# EAGLE design lsmod (EAGLE 7.6.0)
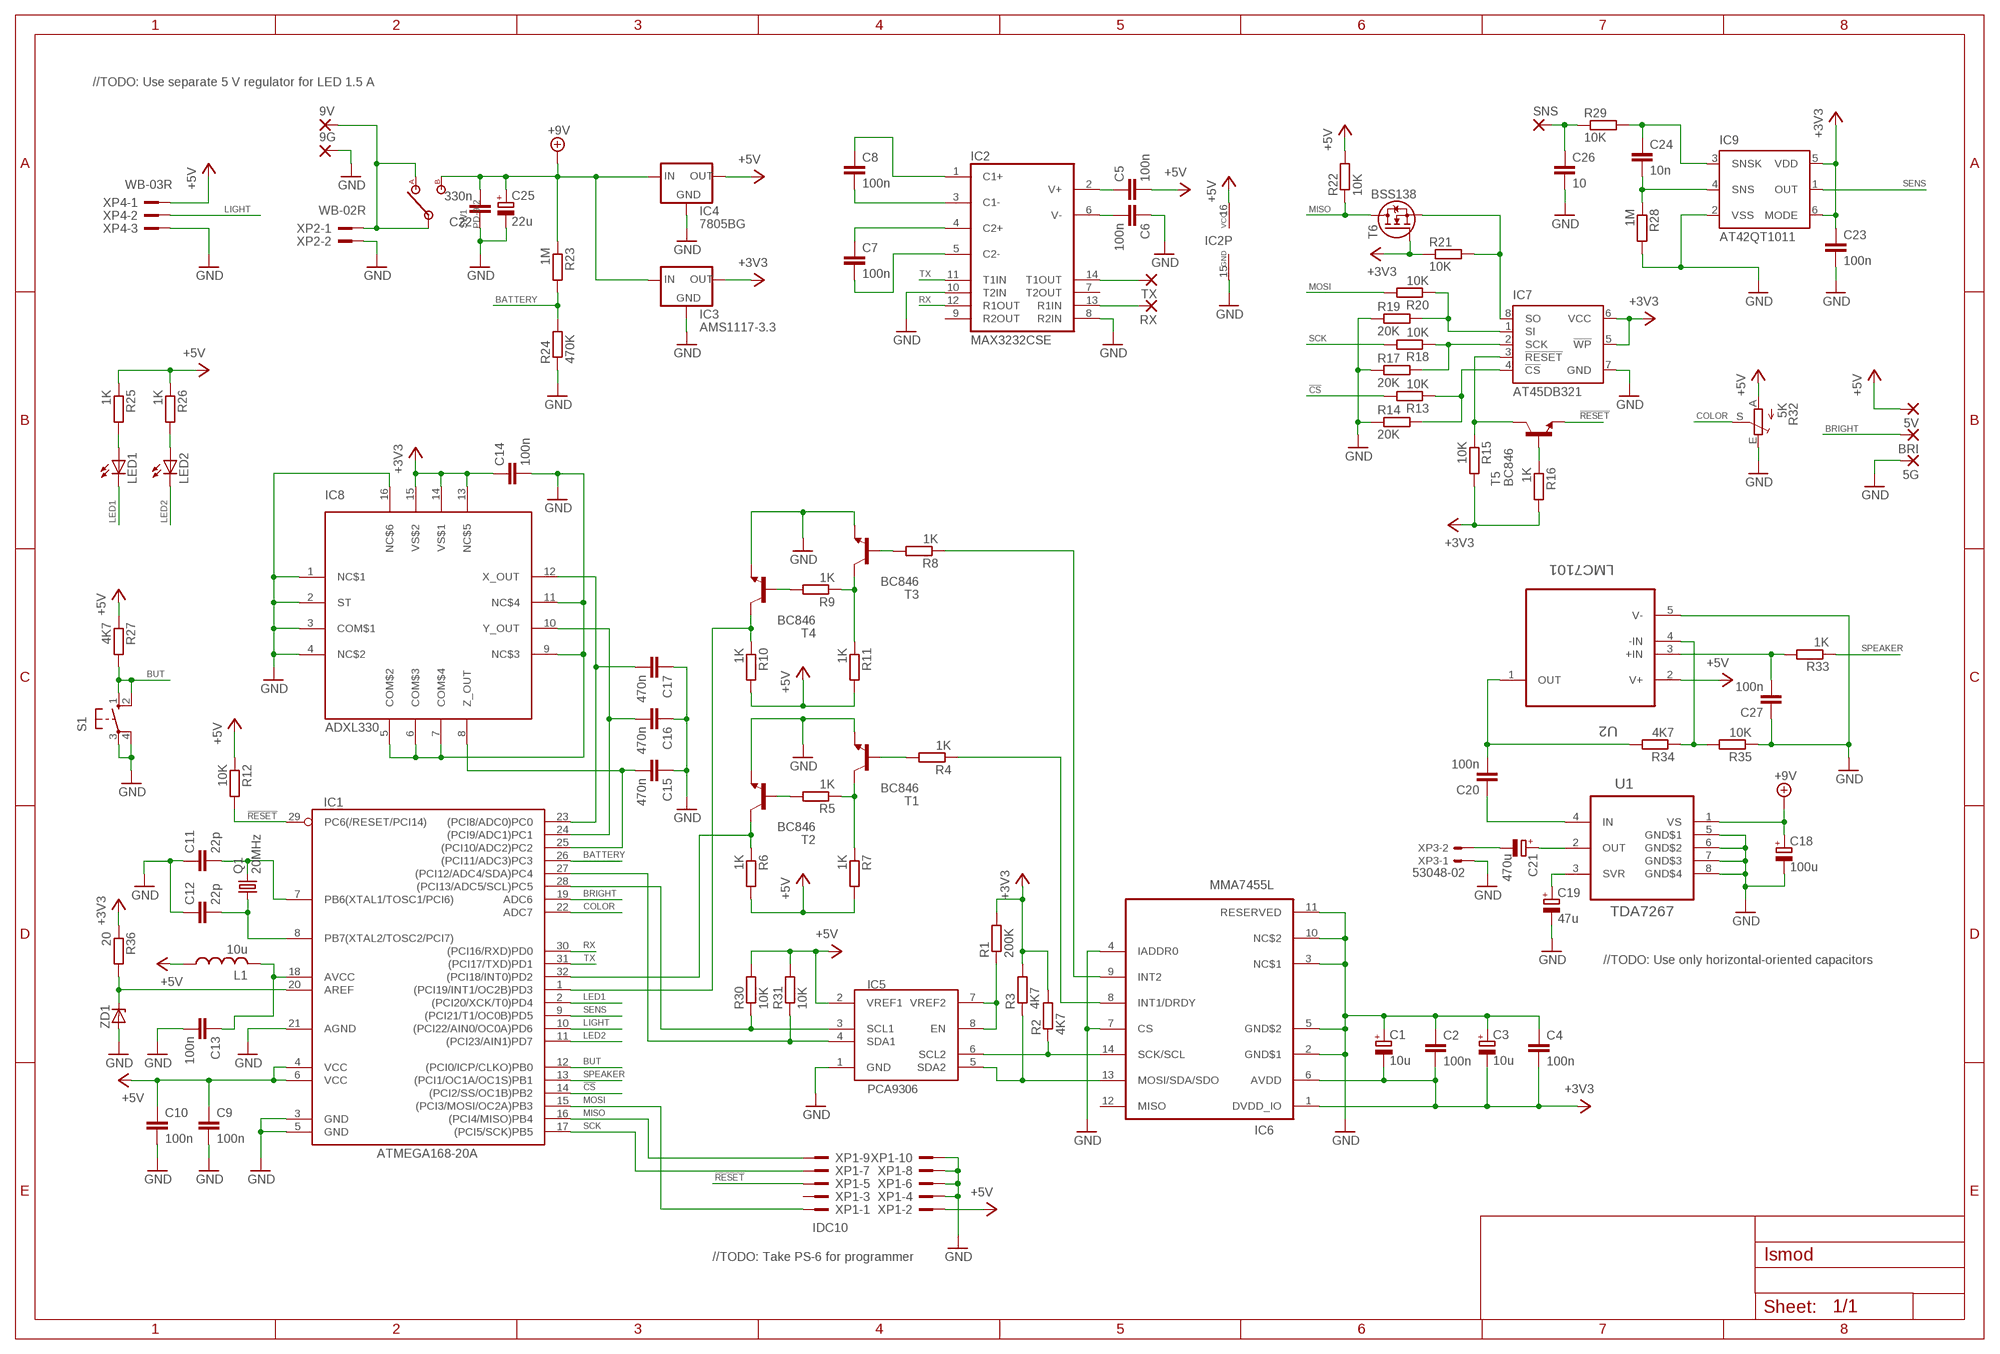
[diagram p0: schematic, sheet 1]

## Parts
5G  2,54/1,0  [2,54/1,0]
5V  2,54/1,0  [2,54/1,0]
9G  2,54/1,0  [2,54/1,0]
9V  2,54/1,0  [2,54/1,0]
BRI  2,54/1,0  [2,54/1,0]
C1  10u  CPOL-EUSMCA  [SMC_A]
C2  100n  C-EUC0805  [C0805]
C3  10u  CPOL-EUSMCA  [SMC_A]
C4  100n  C-EUC0805  [C0805]
C5  100n  C-EUC0805  [C0805]
C6  100n  C-EUC0805  [C0805]
C7  100n  C-EUC0805  [C0805]
C8  100n  C-EUC0805  [C0805]
C9  100n  C-EUC0805  [C0805]
C10  100n  C-EUC0805  [C0805]
C11  22p  C-EUC0805  [C0805]
C12  22p  C-EUC0805  [C0805]
C13  100n  C-EUC0805  [C0805]
C14  100n  C-EUC0805  [C0805]
C15  470n  C-EUC0805  [C0805]
C16  470n  C-EUC0805  [C0805]
C17  470n  C-EUC0805  [C0805]
C18  100u  CPOL-EUE2-5  [E2-5]
C19  47u  CPOL-EUE2-5  [E2-5]
C20  100n  C-EUC0805  [C0805]
C21  470u  CPOL-EUE3.5-8  [E3,5-8]
C22  330n  C-EUC0805  [C0805]
C23  100n  C-EUC0805  [C0805]
C24  10n  C-EUC0805  [C0805]
C25  22u  CPOL-EUE2-5  [E2-5]
C26  10  C-EUC0805  [C0805]
C27  100n  C-EUC0805  [C0805]
IC1  ATMEGA168-20A  [TQFP32-08]
IC2  MAX3232CSE  [SO16]
IC3  AMS1117-3.3  [SOT223]
IC4  7805BG  [DPACK]
IC5  PCA9306  [SM8]
IC6  MMA7455L  [LGA14]
IC7  AT45DB321  [SO08]
IC8  ADXL330  [LFCSP16]
IC9  AT42QT1011  [SOT23-6]
L1  10u  L-USL2012C  [L2012C]
LED1  LED-SMD  [LED-SMD]
LED2  LED-SMD  [LED-SMD]
Q1  20MHz  CRYSTALHC49S  [HC49/S]
R1  200K  R-EU_R0805  [R0805]
R2  4K7  R-EU_R0805  [R0805]
R3  4K7  R-EU_R0805  [R0805]
R4  1K  R-EU_R0805  [R0805]
R5  1K  R-EU_R0805  [R0805]
R6  1K  R-EU_R0805  [R0805]
R7  1K  R-EU_R0805  [R0805]
R8  1K  R-EU_R0805  [R0805]
R9  1K  R-EU_R0805  [R0805]
R10  1K  R-EU_R0805  [R0805]
R11  1K  R-EU_R0805  [R0805]
R12  10K  R-EU_R0805  [R0805]
R13  10K  R-EU_R0805  [R0805]
R14  20K  R-EU_R0805  [R0805]
R15  10K  R-EU_R0805  [R0805]
R16  1K  R-EU_R0805  [R0805]
R17  20K  R-EU_R0805  [R0805]
R18  10K  R-EU_R0805  [R0805]
R19  20K  R-EU_R0805  [R0805]
R20  10K  R-EU_R0805  [R0805]
R21  10K  R-EU_R0805  [R0805]
R22  10K  R-EU_R0805  [R0805]
R23  1M  R-EU_0207/10  [0207/10]
R24  470K  R-EU_0207/10  [0207/10]
R25  1K  R-EU_R0805  [R0805]
R26  1K  R-EU_R0805  [R0805]
R27  4K7  R-EU_R0805  [R0805]
R28  1M  R-EU_R0805  [R0805]
R29  10K  R-EU_R0805  [R0805]
R30  10K  R-EU_R0805  [R0805]
R31  10K  R-EU_R0805  [R0805]
R32  5K  TRIM_EU-B25P  [B25P]
R33  1K  R-EU_R0805  [R0805]
R34  4K7  R-EU_R0805  [R0805]
R35  10K  R-EU_R0805  [R0805]
R36  20  R-EU_R0805  [R0805]
RX  2,54/1,0  [2,54/1,0]
S1  WS7770S  [WS7770S]
SNS  2,54/1,0  [2,54/1,0]
SW1  PD-9-2  [PD-9-2]
T1  BC846  [SOT23]
T2  BC846  [SOT23]
T3  BC846  [SOT23]
T4  BC846  [SOT23]
T5  BC846  [SOT23]
T6  BSS138  NFET-SOT23  [SOT23]
TX  2,54/1,0  [2,54/1,0]
U1  TDA7267  [DIP8]
U2  LMC7101  [SOT23-5]
XP1  IDC10  [BH-10]
XP2  WB-02R  [WB-02R]
XP3  53048-02  [53048-02]
XP4  WB-03R  [WB-03R]
ZD1  ZD-A1-C3  [SOT23]

## Nets
!CS: IC1.14((PCI2/SS/OC1B)PB2) R13.2
!RESET: IC1.29(PC6(/RESET/PCI14)) R12.2 T5.2(E) XP1.5
+3V3: C1.- C2.2 C3.- C4.2 C14.1 C23.1 IC3.2(OUT) IC3.4(OUT) IC6.1(DVDD_IO) IC6.6(AVDD) IC7.5(!WP) IC7.6(VCC) IC8.13(NC$5) IC8.14(VS$1) IC8.15(VS$2) IC9.5(VDD) IC9.6(MODE) R1.2 R2.2 R3.2 R15.2 R16.2 R21.1 R36.1 T6.1(G)
+5V: 5V.1(P) C5.2 C9.1 C10.1 IC1.4(VCC) IC1.6(VCC) IC2.16(VCC) IC4.3(OUT) IC5.2(VREF1) L1.1 R6.2 R7.2 R10.2 R11.2 R12.1 R22.2 R25.1 R26.1 R27.1 R30.2 R31.2 R32.A U2.2(V+) XP1.2 XP4.1
+9V: C18.+ C22.2 C25.+ IC3.3(IN) IC4.1(IN) R23.1 SW1.3(B) U1.1(VS)
BATTERY: IC1.26((PCI11/ADC3)PC3) R23.2 R24.2
BRIGHT: BRI.1(P) IC1.19(ADC6)
BUT: IC1.12((PCI0/ICP/CLKO)PB0) R27.2 S1.1(S) S1.2(S1)
COLOR: IC1.22(ADC7) R32.S
GND: 5G.1(P) 9G.1(P) C1.+ C2.1 C3.+ C4.1 C6.1 C9.2 C10.2 C11.1 C12.1 C13.2 C14.2 C15.1 C16.1 C17.1 C18.- C19.- C22.1 C23.2 C25.- C26.2 C27.1 IC1.3(GND) IC1.5(GND) IC1.21(AGND) IC2.8(R2IN) IC2.10(T2IN) IC2.15(GND) IC3.1(GND) IC4.4(GND) IC5.1(GND) IC6.2(GND$1) IC6.3(NC$1) IC6.4(IADDR0) IC6.5(GND$2) IC6.7(CS) IC6.10(NC$2) IC6.11(RESERVED) IC7.7(GND) IC8.1(NC$1) IC8.2(ST) IC8.3(COM$1) IC8.4(NC$2) IC8.5(COM$2) IC8.6(COM$3) IC8.7(COM$4) IC8.9(NC$3) IC8.11(NC$4) IC8.16(NC$6) IC9.2(VSS) R14.1 R17.1 R19.1 R24.1 R28.2 R32.E R35.1 S1.3(P) S1.4(P1) T1.2(E) T2.2(E) T3.2(E) T4.2(E) U1.5(GND$1) U1.6(GND$2) U1.7(GND$3) U1.8(GND$4) U2.5(V-) XP1.4 XP1.6 XP1.8 XP1.10 XP2.2 XP3.1 XP4.3 ZD1.1(A)
LED1: IC1.2((PCI20/XCK/T0)PD4) LED1.C
LED2: IC1.11((PCI23/AIN1)PD7) LED2.C
LIGHT: IC1.10((PCI22/AIN0/OC0A)PD6) XP4.2
MISO: IC1.16((PCI4/MISO)PB4) R22.1 T6.3(D) XP1.9
MOSI: IC1.15((PCI3/MOSI/OC2A)PB3) R20.2 XP1.1
N$1: IC5.7(VREF2) IC5.8(EN) R1.1
N$2: IC6.9(INT2) R8.1
N$3: IC5.5(SDA2) IC6.13(MOSI/SDA/SDO) R3.1
N$4: IC1.32((PCI18/INT0)PD2) R6.1 T2.3(C)
N$5: R8.2 T3.1(B)
N$6: C5.1 IC2.2(V+)
N$7: IC5.6(SCL2) IC6.14(SCK/SCL) R2.1
N$8: IC6.8(INT1/DRDY) R4.1
N$9: IC1.28((PCI13/ADC5/SCL)PC5) IC5.3(SCL1) R30.1
N$10: IC1.27((PCI12/ADC4/SDA)PC4) IC5.4(SDA1) R31.1
N$11: R4.2 T1.1(B)
N$12: R9.2 T4.1(B)
N$13: R5.1 R7.1 T1.3(C)
N$14: R5.2 T2.1(B)
N$15: IC1.1((PCI19/INT1/OC2B)PD3) R10.1 T4.3(C)
N$16: R9.1 R11.1 T3.3(C)
N$17: C6.2 IC2.6(V-)
N$18: IC2.14(T1OUT) TX.1(P)
N$19: C7.2 IC2.5(C2-)
N$20: C7.1 IC2.4(C2+)
N$21: C8.2 IC2.3(C1-)
N$22: C8.1 IC2.1(C1+)
N$23: IC2.13(R1IN) RX.1(P)
N$24: C13.1 IC1.18(AVCC) L1.2
N$25: C11.2 IC1.7(PB6(XTAL1/TOSC1/PCI6)) Q1.2
N$26: C12.2 IC1.8(PB7(XTAL2/TOSC2/PCI7)) Q1.1
N$28: IC7.4(!CS) R13.1 R14.2
N$29: IC7.3(!RESET) R15.1 T5.3(C)
N$30: R16.1 T5.1(B)
N$31: IC7.1(SI) R19.2 R20.1
N$32: C15.2 IC1.25((PCI10/ADC2)PC2) IC8.8(Z_OUT)
N$33: IC7.8(SO) R21.2 T6.2(S)
N$34: IC7.2(SCK) R17.2 R18.1
N$35: C17.2 IC1.23((PCI8/ADC0)PC0) IC8.12(X_OUT)
N$36: C16.2 IC1.24((PCI9/ADC1)PC1) IC8.10(Y_OUT)
N$37: 9V.1(P) SW1.1(A) SW1.2(IN) XP2.1
N$38: C19.+ U1.3(SVR)
N$39: C20.1 U1.4(IN)
N$40: C21.+ U1.2(OUT)
N$41: C21.- XP3.2
N$42: LED1.A R25.2
N$43: LED2.A R26.2
N$44: C24.2 IC9.4(SNS) R28.1
N$45: C24.1 IC9.3(SNSK) R29.2
N$46: C26.1 R29.1 SNS.1(P)
N$48: C20.2 R34.2 U2.1(OUT)
N$50: C27.2 R33.2 U2.3(+IN)
N$51: R34.1 R35.2 U2.4(-IN)
N$52: IC1.20(AREF) R36.2 ZD1.3(C)
RX: IC1.30((PCI16/RXD)PD0) IC2.12(R1OUT)
SCK: IC1.17((PCI5/SCK)PB5) R18.2 XP1.7
SENS: IC1.9((PCI21/T1/OC0B)PD5) IC9.1(OUT)
SPEAKER: IC1.13((PCI1/OC1A/OC1S)PB1) R33.1
TX: IC1.31((PCI17/TXD)PD1) IC2.11(T1IN)
Unconnected: IC2.7(T2OUT) IC2.9(R2OUT) IC6.12(MISO) XP1.3

## Notes on the sheet
- //TODO: Use separate 5 V regulator for LED 1.5 A
- //TODO: Use only horizontal-oriented capacitors
- //TODO: Take PS-6 for programmer

## Library data of the parts
5G 5V 9G 9V BRI RX SNS TX = wirepad:2,54/1,0: THROUGH-HOLE PAD
C1 C3 C18 C19 C21 C25 = resistor:CPOL-EU: POLARIZED CAPACITOR, European symbol
C2 C4-C17 C20 C22-C24 C26 C27 = resistor:C-EU: CAPACITOR, European symbol
IC1 = avr:ATMEGA168: MICROCONTROLLER 16 kBytes FLASH 1 kBytes SRAM 512 Bytes EEPROM USART 8-channel 10 bit ADC
IC2 = maxim:MAX3232*: True RS-232 Transceivers 3.0V to 5.5V, Low-Power up to 1Mbps, Using Four 0.1µF External Capacitors Source: http://pdfserv.maxim-ic.com/en/ds/MAX3222-MAX3241.pdf; MPN: MAX3232CSE; OC_FARNELL: 9725490; OC_NEWARK: 90C2890
IC3 = device-plus:AMS1117-3.3: 3.3V 500mA Voltage Regulator
IC4 = device-plus:7805BG: 5v Voltage Regulator
IC5 = device-plus:PCA9306: Dual Bidirectional I2C Bus and SMBus Voltage-Level Translator
IC6 = device-plus:MMA7455L: 3-Axis, ±2 g/±4 g/±8 g/±16 g Digital Accelerometer
IC7 = device-plus:AT45DB321: 32-megabit DataFlash
IC8 = device-plus:ADXL330: Small, Low Power, 3-Axis ±3 g iMEMS® Accelerometer
IC9 = device-plus:AT42QT1011: VOLTAGE REGULATOR
L1 = rcl:L-US: INDUCTOR, American symbol
LED1 LED2 = device-plus:LED-SMD: Simple SMD LED Emitter Note: Size might differ from original
Q1 = crystal:CRYSTAL: CRYSTAL; OC_FARNELL: 1667008; OC_NEWARK: unknown
R1-R31 R33-R36 = resistor:R-EU_: RESISTOR, European symbol
R32 = pot:TRIM_EU-: POTENTIOMETER
S1 = switch-plus:WS7770S: Dustproof button; MPN: B3F-1000; OC_FARNELL: 176432; OC_NEWARK: 36M3542
SW1 = switch-plus:PD-9-2: SWITCH SLIDE
T1-T5 = transistor-neu-to92:BC846: NPN TRANSISTOR
T6 = semiconductor:NFET-
U1 = device-plus:TDA7267: 2W MONO AMPLIFIE
U2 = device-plus:LMC7101: Operational Amplifier 1 MHz Single Supply
XP1 = con-plus:IDC10
XP2 = con-plus:WB-02?
XP3 = con-molex:53?-02: CONNECTOR wire to board 1.25 mm (.049 inch) pitch header; MF: MOLEX; MPN: 53048-0210; OC_FARNELL: 1012259; OC_NEWARK: 57H4718
XP4 = con-plus:WB-03?
ZD1 = diodes:ZD-: Zener diode

## Board
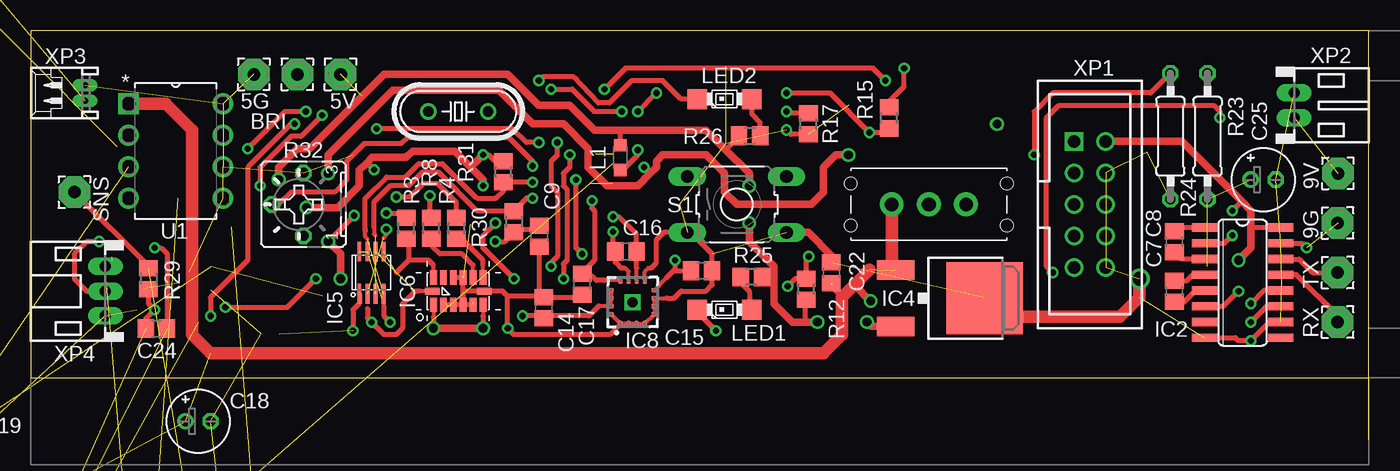
[diagram p1: board, top side]
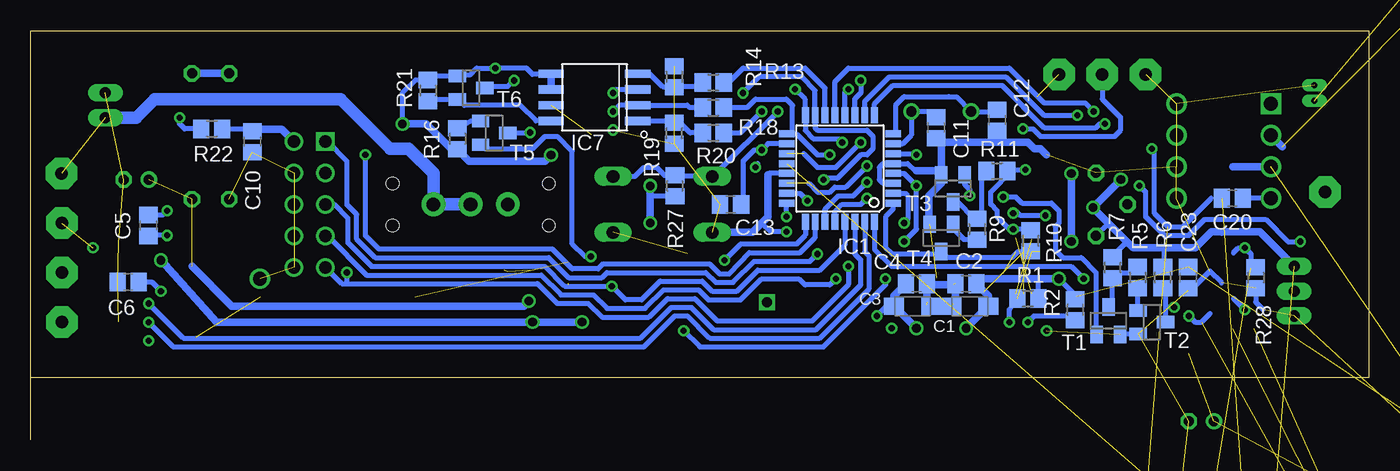
[diagram p2: board, bottom side, seen from below]

Size 108 x 33 mm. Coordinates in mm from the lower left corner, seen from the top.
Outline: 108,5 0,5 0,33 108,33 108,5
Outline: 108,0 108,5
Copper layers (1*16): Top 0.035mm / dielectric 1.5mm / Bottom 0.035mm
Design rules "default": minimum track width 10mil, minimum drill 12mil, track to track 8mil, track to pad 8mil, pad to pad 8mil, via to via 8mil, smd to smd 8mil, copper to edge 40mil, drill to drill 8mil, minimum pad ring 10mil, minimum via ring 8mil, stop-mask expansion 4mil, vias tented up to drill 0mil, thermal gap 10mil
tKeepout: area 0,5 to 108,6; area 0,32 to 108,33; area 108,9 to 118,29; area -10,9 to 0,29
bKeepout: area 0,5 to 108,6; area 0,32 to 108,33; area 108,9 to 118,29; area -10,9 to 0,29

### Footprints (pad centres in the part's own frame; a part is rotated, then mirrored left to right if it is on the bottom)
2,54/1,0 = drill 1.016 pad 2.54 octagon: 1 0,0
SMC_A = smd 1.6 x 1.4: + -1.5,0; - 1.5,0
C0805 = smd 1.3 x 1.5: 1 -0.85,0; 2 0.85,0
E2-5 = drill 0.813 pad 1.27: + -1.016,0 | drill 0.813 pad 1.27 octagon: - 1.016,0
E3,5-8 = drill 0.813 pad 1.6: + -1.778,0 | drill 0.813 pad 1.6 octagon: - 1.778,0
TQFP32-08 = smd 1.27 x 0.559: 1 -4.293,2.8; 2 -4.293,2; 3 -4.293,1.2; 4 -4.293,0.4; 5 -4.293,-0.4; 6 -4.293,-1.2; 7 -4.293,-2; 8 -4.293,-2.8; 17 4.293,-2.8; 18 4.293,-2; 19 4.293,-1.2; 20 4.293,-0.4; 21 4.293,0.4; 22 4.293,1.2; 23 4.293,2; 24 4.293,2.8 | smd 0.559 x 1.27: 9 -2.8,-4.293; 10 -2,-4.293; 11 -1.2,-4.293; 12 -0.4,-4.293; 13 0.4,-4.293; 14 1.2,-4.293; 15 2,-4.293; 16 2.8,-4.293; 25 2.8,4.293; 26 2,4.293; 27 1.2,4.293; 28 0.4,4.293; 29 -0.4,4.293; 30 -1.2,4.293; 31 -2,4.293; 32 -2.8,4.293
SO16 = smd 0.66 x 2.032: 1 -4.445,-3.073; 2 -3.175,-3.073; 3 -1.905,-3.073; 4 -0.635,-3.073; 5 0.635,-3.073; 6 1.905,-3.073; 7 3.175,-3.073; 8 4.445,-3.073; 9 4.445,3.073; 10 3.175,3.073; 11 1.905,3.073; 12 0.635,3.073; 13 -0.635,3.073; 14 -1.905,3.073; 15 -3.175,3.073; 16 -4.445,3.073
SOT223 = smd 1.5 x 2: 1 -2.3,-3.15; 2 0,-3.15; 3 2.3,-3.15 | smd 3.8 x 2: 4 0,3.15
DPACK = smd 1.6 x 3: 1 -2.28,-4.8; 3 2.28,-4.8 | smd 5.8 x 6.2: 4 0,2.38
SM8 = smd 0.3 x 1.6: 1 -0.975,-1.7; 2 -0.325,-1.7; 3 0.325,-1.7; 4 0.975,-1.7; 5 0.975,1.7; 6 0.325,1.7; 7 -0.325,1.7; 8 -0.975,1.7
LGA14 = smd 1.15 x 0.55: 1 -1.1,2; 2 -1.1,1.2; 3 -1.1,0.4; 4 -1.1,-0.4; 5 -1.1,-1.2; 6 -1.1,-2; 8 1.1,-2; 9 1.1,-1.2; 10 1.1,-0.4; 11 1.1,0.4; 12 1.1,1.2; 13 1.1,2 | smd 0.55 x 1.15: 7 0,-2.1; 14 0,2.1
SO08 = smd 0.66 x 2.032: 1 -1.905,-3.498; 2 -0.635,-3.498; 3 0.635,-3.498; 4 1.905,-3.498; 5 1.905,3.498; 6 0.635,3.498; 7 -0.635,3.498; 8 -1.905,3.498
LFCSP16 = smd 0.5 x 0.35: 1 -1.75,0.975; 2 -1.75,0.325; 3 -1.75,-0.325; 4 -1.75,-0.975; 9 1.75,-0.975; 10 1.75,-0.325; 11 1.75,0.325; 12 1.75,0.975 | smd 0.35 x 0.5: 5 -0.975,-1.75; 6 -0.325,-1.75; 7 0.325,-1.75; 8 0.975,-1.75; 13 0.975,1.75; 14 0.325,1.75; 15 -0.325,1.75; 16 -0.975,1.75 | drill 0.8 square: H 0,0
SOT23-6 = smd 0.55 x 1.2: 1 -0.95,-1.3; 2 0,-1.3; 3 0.95,-1.3; 4 0.95,1.3; 5 0,1.3; 6 -0.95,1.3
L2012C = smd 1 x 1: 1 -1,0; 2 1,0
LED-SMD = smd 1.6 x 1.6: A 0,2.2; C 0,-2.2
HC49/S = drill 0.813: 1 -2.413,0; 2 2.413,0
R0805 = smd 1.3 x 1.5: 1 -0.85,0; 2 0.85,0
0207/10 = drill 0.813 octagon: 1 -5.08,0; 2 5.08,0
B25P = drill 0.813 octagon: A -2.54,0; E 2.54,0; S 0,2.54
WS7770S = drill 1.016 long: 1 -4,2.261; 2 4,2.261; 3 -4,-2.261; 4 4,-2.261
PD-9-2 = drill 1.1 pad 1.93: 1 -3,0; 2 0,0; 3 3,0 | hole 1: 6.3,1.7; 6.3,-1.7; -6.3,1.7; -6.3,-1.7
SOT23 = smd 1 x 1.4: 1 -0.95,-1.1; 2 0.95,-1.1; 3 0,1.1
DIP8 = drill 1.118 square: 1 -7.62,7.62 | drill 1.118: 2 -7.62,5.08; 3 -7.62,2.54; 4 -7.62,0; 5 0,0; 6 0,2.54; 7 0,5.08; 8 0,7.62
SOT23-5 = smd 0.55 x 1.2: 1 -0.95,-1.3; 2 0,-1.3; 3 0.95,-1.3; 4 0.95,1.3; 5 -0.95,1.3
BH-10 = drill 1 square: 1 -5.08,-1.27 | drill 1 pad 1.422: 2 -5.08,1.27; 3 -2.54,-1.27; 4 -2.54,1.27; 5 0,-1.27; 6 0,1.27; 7 2.54,-1.27; 8 2.54,1.27; 9 5.08,-1.27; 10 5.08,1.27
WB-02R = drill 0.9 pad 1.27 long: 1 1,0; 2 -1,0
53048-02 = drill 0.5 pad 0.698 long: 1 0.625,-1.25; 2 -0.625,-1.25
WB-03R = drill 0.9 pad 1.27 long: 1 3,0; 2 1,0; 3 -1,0

### Placement (x,y rotation side)
5G  18,29.5 180 top
5V  25,29.5 180 top
9G  105.5,17.5 90 top
9V  105.53,21.5 90 top
BRI  21.5,29.5 180 top
C1  32.19,10.78 0 bottom
C2  32.5,12.6 0 bottom
C3  36.81,10.78 180 bottom
C4  36.5,12.6 180 bottom
C5  98.5,17.3 90 bottom
C6  100.15,12.75 0 bottom
C7  92.32,11.99 270 top
C8  92.32,16 270 top
C9  41.04,16.42 270 top
C10  90.12,24.07 270 bottom
C11  34.9,25.2 90 bottom
C12  30,25.8 90 bottom
C13  51.5,19 180 bottom
C14  41.41,10.66 90 top
C15  54.15,13.65 180 top
C16  48.03,15.19 0 top
C17  44.5,12.56 90 top
C18  13.5,1.5 0 top
C19  -6.5,-0.5 0 top  (outside the outline)
C20  11,19.5 180 bottom
C21  -9,41.5 90 top  (outside the outline)
C22  64.63,13.49 270 top
C23  14.56,13.1 270 bottom
C24  10.13,8.97 0 top
C25  99.5,21 0 top
C26  16.5,-23 0 top  (outside the outline)
C27  12,-37 0 top  (outside the outline)
IC1  42.68,21.9 180 bottom
IC2  97.83,12.69 270 top
IC3  -14.5,-8.5 0 top  (outside the outline)
IC4  74.62,11.43 270 top
IC5  27.5,13.5 0 top
IC6  34.5,12 90 top
IC7  62.5,27.64 90 bottom
IC8  48.58,11.11 90 top
IC9  -16,-44 0 top  (outside the outline)
L1  47.59,22.78 270 top
LED1  56,10.5 270 top
LED2  56,27.5 270 top
Q1  34.5,26.5 0 top
R1  27.5,11.4 0 bottom
R2  23.68,10.5 90 bottom
R3  30.3,17.08 90 top
R4  34.36,17.08 90 top
R5  18.64,13.1 270 bottom
R6  16.61,13.1 90 bottom
R7  20.67,13.9 90 bottom
R8  32.33,17.08 90 top
R9  31.6,17 270 bottom
R10  27.29,16.07 90 bottom
R11  30,21.7 0 bottom
R12  62.6,12.16 90 top
R13  52.91,28.84 0 bottom
R14  56.06,29.3 270 bottom
R15  69.28,25.98 90 top
R16  73.56,24.3 270 bottom
R17  62.78,25.5 90 top
R18  52.91,26.81 0 bottom
R19  56.06,24.75 90 bottom
R20  52.91,24.78 0 bottom
R21  75.94,28.19 270 bottom
R22  93.4,25.1 0 bottom
R23  95,24.5 90 top
R24  92,24.5 90 top
R25  58.16,13.15 180 top
R26  58.03,24.54 0 top
R27  56,20.5 90 bottom
R28  9.11,13.09 270 bottom
R29  9.5,13 270 top
R30  39,17.6 270 top
R31  38.15,21.63 90 top
R32  22,19 90 top
R33  21,-33 0 top  (outside the outline)
R34  16,-28.5 0 top  (outside the outline)
R35  5.5,-34.5 0 top  (outside the outline)
R36  -23,-51 0 top  (outside the outline)
RX  105.5,9.5 90 top
S1  57,19 0 top
SNS  3.5,20 270 top
SW1  72.5,19 180 top
T1  21,9.61 0 bottom
T2  17.5,9.5 270 bottom
T3  33.55,20.3 180 bottom
T4  34.5,16.3 180 bottom
T5  70.6,24.77 270 bottom
T6  72.46,28.41 270 bottom
TX  105.5,13.5 90 top
U1  15.5,19.5 0 top
U2  9.5,-27 0 top  (outside the outline)
XP1  85.5,19 270 top
XP2  102,27 270 top
XP3  3.13,28 90 top
XP4  6,11 90 top
ZD1  -20.5,-37.5 0 top  (outside the outline)

### Tracks (layer width: path | path; a pad name or v marks a point on that pad's centre or on a via)
!CS
  Bottom 0.406: IC1.14 43.88,28.38 45.5,30 50.5,30 51.56,28.94 R13.2
!RESET  (via drill 0.5)
  Top 0.406: v62.8,14.8 62.6,14.6 R12.2 61.71,13.01 v61.1,12.4
  Bottom 0.406: T5.2 71.38,23.5 67.5,23.5 66.5,24.5 65.5,24.5 64.3,23.3 64.3,15.8 63.3,14.8 v62.8,14.8 | IC1.29 42.28,15.72 44.3,13.7 49.3,13.7 51,12 53,12 53.8,12.8 57.2,12.8 58.7,11.3 60,11.3 v61.1,12.4 64.9,12.4 66.5,14 80.5,14 82.4,15.9 82.4,17.9 83.5,19 XP1.5
+3V3  (via drill 0.5, 0.7)  (6 unrouted)
  Top 0.305: IC8.13 IC8.14 IC8.15 45.83,10.79 | IC6.1 32.5,9.9 | IC6.6 36.5,10
  Top 0.406: v70.5,30 70.5,28.5 69.28,27.28 R15.2 | v39.7,10 41.4,10 C14.1 41.5,9.9 41.5,10 41.51,10.01 45.05,10.01 45.83,10.79 | v49.5,22 50,21.5 | R3.2 30.07,17.93 29.7,18.3 v28.7,18.3 | 32.5,9.9 v32.5,9 | 36.5,10 v36.5,9 | v26.1,18.1 v24,16
  Top 0.61: 78.24,25.26 v78,25.5 | v66,23 65,23 64,22 64,20 63,19 57,19 56,20 56,21.5 54.5,23 51,23 50.5,22.5 50.5,22 50,21.5 49,20.5 46.5,20.5 45,22 45,23.5 43,25.5 40.5,25.5 37.8,28.2 29.2,28.2 24,23 v24,21.5 | v32.5,9 v36.5,9 | v25,13 25,15 v24,16
  Bottom 0.406: v78,25.5 78,28 76.96,29.04 R21.1 75.62,29.36 T6.1 73.5,29.42 73.5,29.5 73.44,29.44 72.56,29.44 72,30 v70.5,30 68,30 67.5,29.5 66,29.5 | 49.3,22.3 v49.5,22 | v26.1,18.1 28.1,18.1 28.3,18.3 v28.7,18.3 | 23.6,11.6 R2.2 23.68,11.68 v25,13 | R1.2 26.65,12.85 27,13 | v39.7,10 38.92,10.78 C3.-
  Bottom 0.61: v78,25.5 76.08,25.5 74.03,23.45 R16.2 72.61,22.5 66.5,22.5 v66,23 | IC7.6 66,29.5 IC7.5 | v25,13 27,13 31.25,13 C2.2 30.69,11.64 C1.- 30.72,10.78 v32.5,9 | v24,16 v24,21.5 | v36.5,9 38.28,10.78 C3.- 38.31,11.64 C4.2
+5V  (via drill 0.5, 0.7)  (3 unrouted)
  Top 0.305: v28.7,17 28.7,16.57 28.48,16.3
  Top 0.406: R26.1 56.14,23.5 56,23.5 | L1.1 47.59,25 45.5,25 | R31.2 37.48,22.48 36.96,23 v36.5,23 | v37.5,16 38.25,16 R30.2 39.25,17 40.77,17 C9.1 | R12.1 62.5,10.87 62.5,9.5 | v27.7,21.8 27.12,22.38 | IC2.16 98.64,17.13 98.5,17 | R25.1 59.16,13 60,13 | v97,18.5 97.75,19.25
  Top 0.61: IC4.3 67.85,9.15 v67.5,9.5 | v63.5,9.5 62.5,9.5 61.5,9.5 60,11 60,13 60,14 58,16 v58,17.5 | v58,20.5 58,21.5 56,23.5 54.5,25 45.5,25 43.5,27 41,27 38.5,29.5 28.5,29.5 26.75,27.75 22.5,23.5 21.5,23.5 20,22 v20,21 | 35.5,22 34.2,23.3 30.8,23.3 30.3,22.8 27.55,22.8 27.12,22.38 26.5,21.75 26.5,20.5 24.75,18.75 v22.25,18.75 | v36.5,23 35.5,22 | v36.5,20.5 36.5,21 35.5,22 | v97.5,14.5 98.5,15.5 98.5,17 98.5,18.5 97.75,19.25 92.92,24.08 XP1.2
  Bottom 0.406: R27.1 57.85,19.65 58,19.5 | v37.5,16 36.5,17 v36.5,20.5 37.5,21.5 IC1.4 | R11.2 28.8,21.7 | IC1.6 36.6,23.1 v36.5,23 | R22.2 90.8,25.1 C10.1 | R11.2 29.15,21.85 | 29.08,21.7 R11.2 | R10.2 27.37,17 v28.7,17 29,17 30,18 30,18.5 30.5,19 30.5,20 28.8,21.7 | 28.8,21.7 28.7,21.7 28.7,21.8 v27.7,21.8 | R6.2 16.55,13.95 16.49,14.01 16.49,15.46 | R32.A 22,16.5 21,17.5 | 16.05,15.45 16.49,15.46 | 16.49,15.46 19,15.5 | 19.5,16 20.5,15 20.5,14.42 R7.2 | 14.56,15.44 14,15.5 | 11.86,16.66 12,16.8 | C5.2 97.35,18.15 v97,18.5
  Bottom 0.61: v63.5,9.5 v67.5,9.5 93,9.5 v97.5,14.5 | v58,17.5 58,19.5 v58,20.5 | C10.1 90.08,24.92 90,25 89.58,25.08 87.77,25.08 XP1.2 | v20,21 v22.25,18.75 21,17.5 19.5,16 19,15.5 14,15.5 12.7,16.8 12,16.8 8.8,16.8 XP4.1
+9V  (via drill 0.7)  (7 unrouted)
  Top 0.61: v67.8,11.2 66.5,12.5 | 65.5,11.5 65.5,11.65 64.63,12.52
  Top 1.016: 69.5,13.59 SW1.3 69.5,19.33 | 67.71,13.71 66.5,12.5 65.5,11.5 65.5,8.5 64,7 14.5,7 13,8.5 13,25 10.88,27.12 U1.1
  Bottom 0.61: v67.8,11.2 68.2,10.8 91.8,10.8 95,14
BATTERY  (via drill 0.5)
  Top 0.406: v81,23 81,26.5 82.5,28 90.42,28 R24.2
  Bottom 0.406: v81,23 81,16.5 79.9,15.4 65.9,15.4 64.3,13.8 62.2,13.8 61.8,14.2 53.2,14.2 52.4,13.4 51.6,13.4 50,15.1 45.9,15.1 44.68,16.32 IC1.26
  Bottom 0.61: R23.2 R24.2
BRIGHT  (via drill 0.5)  (1 unrouted)
  Top 0.406: v41,24 40,24 38.9,25.1 v27.9,25.1
  Bottom 0.406: 45.6,23.1 44.5,22 43,22 v41,24 | v27.9,25.1 27.1,25.1 26.5,24.5 20.5,24.5 20,25 20,26 21.5,27.5 BRI.1
BUT  (via drill 0.5)
  Top 0.406: v47.7,26.5 45.5,26.5 43.7,28.3 v42,28.3
  Bottom 0.406: S1.2 59.24,21.26 58.5,22 57.5,22 56.85,21.35 R27.2 56,21.5 55.76,21.26 S1.1 52.94,21.26 v47.7,26.5 | IC1.12 42.28,28.02 v42,28.3
COLOR  (via drill 0.5)  (1 unrouted)
  Top 0.406: R32.S 20,19 21,20 24.5,20 25.5,21 25.5,22.5 26.9,23.9 29.9,23.9 30.4,24.4 38.6,24.4 40.5,22.5 v40.5,22.1
  Bottom 0.406: 45.2,20.7 44.5,20 43.5,20 43.1,20.4 42.2,20.4 v40.5,22.1
GND  (via drill 0.5, 1.1)  (44 unrouted)
  Top 0.305: IC8.4 IC8.3 IC8.2 | IC8.2 IC8.1 IC8.16 | IC8.2 IC8.4 | IC8.4 IC8.5 IC8.6 IC8.7 51.33,11.43 | 47.86,13.86 48,13.86 48.26,13.61 IC8.11 | 50.05,13.86 49.86,13.86 49.55,13.55 IC8.9
  Top 0.406: IC6.5 IC6.4 | IC6.4 IC6.3 IC6.2 | IC6.11 IC6.10 IC6.4 | 47.86,13.86 47.64,13.86 47.18,14.32 C16.1 47,15.37 v47,16.8 | 50.05,13.86 50.5,14.3 50.5,16.14 51.1,16.74 S1.3 53.26,16.74 55,15 C15.1 55,12.5 54.5,12 52.5,12 51.94,11.43 51.33,11.43 | R17.1 61.35,24.65 v61,25 | 40.91,11.59 C14.2 44,11.5 44.5,12 C17.1 | 40.91,11.59 41,11.5 | 38.5,11.59 v38.5,9 39,8.5 46.74,8.5 IC8.1 | 40.91,11.59 38.5,11.59 | 38.5,11.59 38.09,12 IC6.7 34.9,12 IC6.4 | v26,8.8 26,10.5 26.52,11.03 IC5.1 | IC2.15 102.64,15.87 v103,15.5 | C9.2 41.04,11.72 40.91,11.59 | IC2.10 100.02,9.52 v98.5,8 97.5,8 97.25,8.25 IC2.8 | IC4.4 77,11.5
  Top 0.61: S1.4 62.76,16.74 64.63,14.87 C22.1
  Top 1.016: v89.5,13 89.5,11.5 87.93,9.93 78.57,9.93 77,11.5
  Bottom 0.406: IC1.3 39.2,20.7 39.5,21 39.5,22 39.2,22.3 IC1.5 37.2,22.3 36.6,21.7 36.5,21.7 | IC1.21 48.4,21.5 48.5,21.4 | T1.2 19.96,8.55 T2.2 | v47,16.8 48.3,16.8 49,17.5 | 14.25,12.25 C23.2 14.56,12.06 14.5,12 14.42,12 12.81,13.61 11.86,12.66 | R28.2 9.11,11.11 8.5,10.5
  Bottom 0.61: T4.2 35.5,17.45 35.5,19.7 34.5,20.7 T3.2 34.8,21.7 | S1.3 49.76,16.74 49,17.5 48.5,18 48.5,21.4 | 33.5,12.5 35.65,12.5 C4.1 35.65,11.12 C3.+ | 36.5,21.7 34.8,21.7 | 34.8,21.7 34.5,22 34.5,24 | 34.55,24 34.5,24 | 34.5,24 34.9,24.4 | C11.1 34.9,24.4 | 34.9,24.4 35,24.5 | 34.5,24 30,24 | 30,24 C12.1 | 30,24 27.5,24 27,23.5 26.5,23.5 26,23 | C2.1 33.35,11.15 33.5,11
LED1  (via drill 0.5)
  Top 0.406: v39,13 36.5,15.5 36.5,16.5 v37.5,17.5 | 54,10 54.1,10 | 54.1,10 v55.3,8.8 | LED1.C 54.1,10.5 54.1,10
  Bottom 0.406: v55.3,8.8 54,7.5 44,7.5 39,12.5 v39,13 | IC1.2 37.4,19.9 37.2,19.7 37.2,17.8 v37.5,17.5
LED2  (via drill 0.5)
  Top 0.406: v41,29 41.3,29.3 43.8,29.3 45.8,27.2 46.7,27.2 48.5,29 51,29 52.5,27.5 LED2.C
  Bottom 0.406: v41,29 41,28 41.48,27.52 IC1.11
LIGHT  (via drill 0.5)
  Top 0.406: v23.5,26.2 21.8,24.5 21,24.5 18.5,22 v18.5,20.5 | v5.5,16 4.5,16 3.5,15 3.5,13 4.5,12 XP4.2
  Bottom 0.406: IC1.10 40.68,27.32 38.7,29.3 29.3,29.3 26.2,26.2 v23.5,26.2 | v5.5,16 6.5,16 8.3,17.8 13.2,17.8 14.5,16.5 16.5,16.5 18,18 18,20 v18.5,20.5
MISO  (via drill 0.5)
  Top 0.406: v69,29 68,30 48,30 v46.3,28.3 46.2,28.3 | v42.5,24 42.5,23 42,22.5 42,20.5 42.5,20 42.5,14.8 42,14.3 v42,14 | v96,26 96,26.5 95.5,27 83,27 82,26 82,14 v82.5,13.5
  Bottom 0.406: 82.5,12.6 82.91,12.6 XP1.9 | 82.5,12.6 67.1,12.6 65.5,11 63,11 61.9,9.9 58.1,9.9 56.6,11.4 54.4,11.4 52.6,9.6 44.9,9.6 42,12.5 v42,14 | v69,29 69.5,28.5 71.27,28.5 T6.3 | v42.5,24 42.8,24.3 44.8,24.3 45.48,24.98 IC1.16 45.48,27.48 v46.3,28.3 | R22.1 95.6,25.1 96,25.5 v96,26 | v82.5,13.5 82.5,12.6
MOSI  (via drill 0.5)
  Top 0.406: v44.5,15 44,15.5 v44,21 | v49,26.5 v50.5,28
  Bottom 0.406: v50.5,28 49.2,29.3 45.8,29.3 44.68,28.18 IC1.15 44.68,25.18 44.5,25 40.5,25 40,24.5 40,23.5 40.5,23 41,23 42.9,21.1 43.9,21.1 v44,21 | R20.2 50.72,24.78 v49,26.5 | v44.5,15 45.1,14.4 49.6,14.4 51.3,12.7 52.7,12.7 53.5,13.5 61.5,13.5 61.9,13.1 64.6,13.1 66.2,14.7 80.2,14.7 81.7,16.2 81.7,18.2 82.5,19 82.5,22.5 84.08,24.08 XP1.1
N$1  (via drill 0.5)  (2 unrouted)
  Top 0.406: 28.48,10.8 28.48,10.03 v29,9.5
  Bottom 0.406: v29,9.5 29,10.5 28.4,11.4 R1.1
N$2
  Top 0.305: IC6.9 35.7,14.1
  Top 0.406: 35.7,14.1 34.8,15 33,15 32.48,15.52 R8.1
N$3  (1 unrouted)
  Top 0.305: IC6.13 32.5,14.1
  Top 0.406: 29.5,13.5 30.5,14.5 | 32.5,14.1 32.1,14.5 30.5,14.5 | R3.1 30.5,16.18 30.5,14.5
N$4  (via drill 0.5)
  Top 0.406: v15.7,10.7 20.7,10.7 v23,13
  Bottom 0.406: IC1.32 39.88,15.38 38.5,14 24,14 v23,13 | 16.5,12.14 R6.1 16.4,12.04 16.4,10.7 | 16.4,10.7 T2.3 | v15.7,10.7 16.4,10.7
N$5  (via drill 0.5)
  Top 0.406: v32.2,19.7 32.2,18.2 | 32.2,18.2 32,18 | R8.2 32.33,18.07 32.2,18.2
  Bottom 0.406: T3.1 32.6,20.6 32.2,20.2 v32.2,19.7
N$6  (via drill 0.5)
  Top 0.406: v97,16.5 96.36,15.87 IC2.2
  Bottom 0.406: v97,16.5 98.09,16.5 C5.1
N$7  (via drill 0.5)  (1 unrouted)
  Top 0.305: IC6.14 31.4,12
  Top 0.406: 27.18,10.6 27.18,9.82 v27.5,9.5 28.5,8.5 29.5,8.5 30,9 30,11 31,12 31.4,12
  Bottom 0.406: v27.5,9.5 27,10 24,10 23.68,9.68 R2.1
N$8
  Top 0.305: IC6.8 36.5,14.1
  Top 0.406: 36.5,14.1 36.5,14.5 34.77,16.23 R4.1
N$9  (via drill 0.5)  (1 unrouted)
  Top 0.305: 27.7,17.12 27.7,16.62 27.82,16.5
  Top 0.406: 27.7,17.12 27.7,19.2 29,20.5 30.5,20.5 31.6,21.6 32.9,21.6 36,18.5 38.95,18.5 R30.1 39,18.5 40,19.5 v40.5,19.5
  Bottom 0.406: IC1.28 43.08,18.42 42.5,19 41,19 v40.5,19.5
N$10  (via drill 0.5)  (1 unrouted)
  Top 0.305: 27.18,16.2 27,16.38 27,17
  Top 0.406: 27,16.88 27,17 27,19.5 28.7,21.2 30.2,21.2 31.3,22.3 33.2,22.3 36,19.5 37.57,19.5 38.15,20.08 R31.1 38.17,20.8 v40.5,20.8
  Bottom 0.406: IC1.27 43.88,18.62 42.8,19.7 41.6,19.7 v40.5,20.8
N$11  (via drill 0.5)
  Top 0.406: v29.5,19.6 30.6,19.6 31.7,20.7 32.8,20.7 34.36,19.14 R4.2
  Bottom 0.406: v29.5,19.6 28.5,19.6 28,19.1 25.6,19.1 25,18.5 25,17.5 25.3,17.2 25.3,15.3 24.7,14.7 23.2,14.7 22,13.5 22,8.56 T1.1
N$12
  Bottom 0.406: T4.1 33.4,17.4 33.4,16.9 32.65,16.15 R9.2
N$13
  Bottom 0.406: T1.3 20.67,10.99 R7.1 20.67,13.5 19,13.5 19,13.95 R5.1
N$14
  Bottom 0.406: 18.5,12.11 R5.2 18.64,10.49 T2.1
N$15
  Bottom 0.406: IC1.1 38.39,18.61 39,18 39,15.5 38.5,15 34.7,15 T4.3 34,14.7 28.8,14.7 28.28,15.22 R10.1 27.25,15.45
N$16
  Bottom 0.406: R9.1 31.1,18.1 31.25,18.25 | R11.1 31.2,21.85 31.2,18.25 R9.1 | T3.3 33.2,19.2 31.85,17.85 R9.1
N$17  (via drill 0.5)
  Top 0.406: v97.5,12 96.28,10.79 IC2.6
  Bottom 0.406: C6.2 98.25,12.75 v97.5,12
N$18
  Top 0.406: TX.1 103.5,13.5 102.41,14.6 IC2.14
N$19
  Top 0.406: C7.2 93.14,11.14 94.06,12.05 IC2.5
N$20
  Top 0.406: IC2.4 93.83,13.32 93.34,12.84 C7.1
N$21
  Top 0.406: C8.2 92.35,15.15 92.91,14.6 IC2.3
N$22
  Top 0.406: C8.1 92.35,16.85 92.64,17.13 IC2.1
N$23
  Top 0.406: RX.1 105.5,10 102.17,13.32 IC2.13
N$24  (via drill 0.5)
  Top 0.406: v49,23.4 49,23 48,22 L1.2
  Bottom 0.406: IC1.18 48.5,23.9 v49,23.4 49.6,23.4 50.5,22.5 50.5,19.5 50.65,19.35 C13.1
N$25
  Bottom 0.406: IC1.7 37.6,23.9 36.91,24.59 Q1.2 35.35,26.5 C11.2
N$26
  Bottom 0.406: 38.41,24.73 IC1.8 38.2,24.7 38.2,27 37.5,27.7 33.89,27.7 33.69,27.69 33.27,27.69 Q1.1 30.15,26.5 C12.2
N$28
  Bottom 0.406: IC7.4 58.05,29.55 57,28.5 56.17,28.5 R14.2 56,28.45 56,28.5 53.68,28.5 53.55,28.63 R13.1
N$29  (via drill 0.5)
  Top 0.406: v61,28 64.5,28 v67.7,24.8 68.95,24.8 R15.1
  Bottom 0.406: IC7.3 60.73,28.27 v61,28 | T5.3 67.73,24.77 v67.7,24.8
N$30
  Bottom 0.406: T5.1 72.49,25.72 R16.1
N$31
  Bottom 0.406: R20.1 54.78,24.78 55.5,25.5 55.96,25.5 R19.2 56.33,25.73 IC7.1
N$32  (via drill 0.5)
  Top 0.305: IC8.8 51.33,13.09
  Top 0.406: 51.9,13.65 C15.2 | v52,14.5 52,13.76 51.9,13.65 | 51.9,13.65 51.33,13.09
  Bottom 0.406: IC1.25 45.48,16.52 46.2,15.8 50.7,15.8 v52,14.5
N$33
  Bottom 0.406: IC7.8 67.23,25.73 68.5,27 73,27 73.5,27.5 73.52,27.5 T6.2 75.82,27.46 R21.2
N$34  (via drill 0.5)
  Top 0.406: R17.2 61.15,26.35 v61,26.5
  Bottom 0.406: IC7.2 60.5,27 v61,26.5 | IC7.2 55.01,27 54.81,26.81 R18.1
  Bottom 0.61: IC7.2
N$35  (via drill 0.5)
  Top 0.305: IC8.12 46.33,12.86
  Top 0.406: v45.3,19.3 45.3,18.7 45.5,18.5 45.5,14.5 44.5,13.5 | 44.71,13.5 C17.2 44.5,13.5 | 46.33,12.86 45.64,12.86 45,13.5 44.5,13.5
  Bottom 0.406: IC1.23 45.9,19.9 v45.3,19.3
N$36  (via drill 0.5)
  Top 0.305: IC8.10 48.91,13.86
  Top 0.406: v47,18 47.5,18 48.88,16.62 C16.2 48.91,15.16 48.91,13.86
  Bottom 0.406: v47,18 47,19.07 IC1.24
N$37  (1 unrouted)
  Bottom 1.016: SW1.2 SW1.1 75.5,21.5 77.5,23.5 79,23.5 83,27.5 98,27.5 99.5,26 XP2.1
N$38  (1 unrouted)
  Bottom 0.61: U1.3 10.96,22.04
N$39
  Bottom 0.406: U1.4 C20.1
N$40  (1 unrouted)
  Bottom 0.61: U1.2 6.95,23.65
N$41  (1 unrouted)
N$42
  Top 0.406: R25.2 57.31,12.69 58,12 58,10.5 LED1.A
N$43
  Top 0.406: R26.2 58.88,25.62 58.2,26.3 LED2.A
N$44  (via drill 0.5)  (1 unrouted)
  Top 0.406: v10,15.5 10.5,15.5 11,15 11,9.5 10.98,9.48 C24.2
  Bottom 0.406: R28.1 9.44,14.44 9.52,14.52 9.5,14.54 9.5,15 v10,15.5 10.5,15.5 10.91,15.09
N$45  (via drill 0.5)  (1 unrouted)
  Top 0.406: R29.2 9.5,11 v10,10.5 9.28,9.78 C24.1
  Bottom 0.406: 10.91,11.41 v10,10.5
N$46  (1 unrouted)
  Top 0.406: SNS.1 9.5,14
  Top 0.61: R29.1 9.5,14
N$48  (2 unrouted)
N$50  (2 unrouted)
N$51  (2 unrouted)
N$52  (2 unrouted)
RX  (via drill 0.5)
  Top 0.406: v98.5,11 99.56,12.05 IC2.12
  Bottom 0.406: v98.5,11 95.7,8.2 58.8,8.2 56.3,10.7 54.7,10.7 52.9,8.9 44.6,8.9 41,12.5 41,14.5 41.48,14.98 IC1.30
SCK  (via drill 0.5)
  Top 0.406: v43.5,23 43.5,22 43,21.5 43,20.5 43.3,20.2 43.3,14.5 43,14.2 v43,13
  Bottom 0.406: v43,13 43.5,12.5 45.5,12.5 46,13 49,13 50.7,11.3 53.3,11.3 54.1,12.1 56.9,12.1 58.4,10.6 61.5,10.6 62.6,11.7 65.2,11.7 66.8,13.3 80.9,13.3 84.06,16.46 XP1.7 | R18.2 52.06,26.44 51.69,26.81 50.19,26.81 49.5,27.5 47,27.5 46.5,27 46.5,24.7 IC1.17 46.2,24.7 44.5,23 v43.5,23
SENS  (via drill 0.5)  (1 unrouted)
  Top 0.406: v21.3,25.5 21,25.5 17.5,22 17.5,14.5 14.5,11.5 v14.5,10
  Bottom 0.406: 39.88,26.62 IC1.9 39.88,27.12 38.4,28.6 29.6,28.6 26.2,25.2 22,25.2 21.7,25.5 v21.3,25.5 | v14.5,10 14,9.5 13.5,9.5 12.81,10.19
SPEAKER  (via drill 0.5)  (1 unrouted)
  Top 0.406: v22.2,26.5 20.5,26.5 v17.5,23.5
  Bottom 0.406: IC1.13 43.08,28.92 42,30 29,30 26.2,27.2 22.9,27.2 v22.2,26.5 | 12.7,19.5 15,17.2 16.2,17.2 17.3,18.3 17.3,23.3 v17.5,23.5
TX  (via drill 0.5)
  Top 0.406: v98.5,9.5 99.78,10.79 IC2.11
  Bottom 0.406: v98.5,9.5 96.5,7.5 58.5,7.5 56,10 55,10 53.2,8.2 44.3,8.2 40.3,12.2 40.3,14.8 40.68,15.18 IC1.31